# Altium schematic sheet IMU.SchDoc: Smart Bus Ticketing Machine/IMU
size A4; Date: 3/10/2025; ApprovedBy: Kiran Gunathilaka; CheckedBy: Kiran Gunathilaka; Author: Kiran Gunathilaka; DrawnBy: Kiran Gunathilaka; DocumentNumber: 05; Revision: v1.1; SheetNumber: 4; SheetTotal: 11
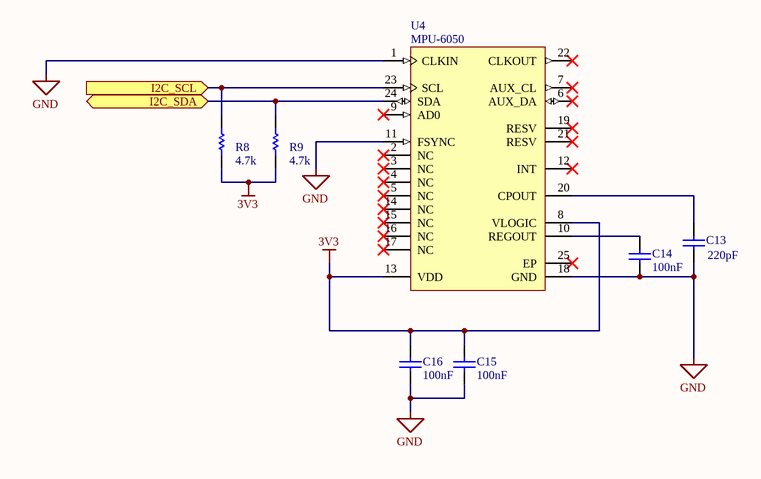
[diagram p0: IMU.SchDoc]

## Parts
C13  value 220pF  [CAPC2013X88X50ML20T25]  (hidden comment: C0805C221J5GACTU)
C14  value 100nF  [CAPC2013X94X50ML20T25]  (hidden comment: 08051C152KAT2A)
C15  value 100nF  [CAPC2013X94X50ML20T25]  (hidden comment: 08051C152KAT2A)
C16  value 100nF  [CAPC2013X94X50ML20T25]  (hidden comment: 08051C152KAT2A)
R8  value 4.7k  [RESC2013X60X40ML20T25]  (hidden comment: ERA6AEB472V)
R9  value 4.7k  [RESC2013X60X40ML20T25]  (hidden comment: ERA6AEB472V)
U4  MPU-6050  [IS-QFN-24_V]

## Ports
I2C_SCL (in, see Main[2C], MCU[3B]), I2C_SDA (bidir, see Main[2C], MCU[3B])

## Nets
3V3: C15.2 C16.2 R8.1 R9.1 U4.8(VLOGIC) U4.13(VDD)
GND: C13.1 C14.1 C15.1 C16.1 U4.1(CLKIN) U4.11(FSYNC) U4.18(GND)
I2C_SCL: R8.2 U4.23(SCL) ; port I2C_SCL
I2C_SDA: R9.2 U4.24(SDA) ; port I2C_SDA
NetC13_2: C13.2 U4.20(CPOUT)
NetC14_2: C14.2 U4.10(REGOUT)

Not connected (* = marked no-connect by the designer): U4 2(NC)* 3(NC)* 4(NC)* 5(NC)* 6(AUX_DA)* 7(AUX_CL)* 9(AD0)* 12(INT)* 14(NC)* 15(NC)* 16(NC)* 17(NC)* 19(RESV)* 21(RESV)* 22(CLKOUT)* 25(EP)*

## Library data of the parts
C13 = CMP-2007-00316-1: Manufacturer: Kemet; Part Number: C0805C221J5GACTU
C14-C16 = CMP-2007-04179-1: Manufacturer: AVX Interconnect / Elco; Part Number: 08051C152KAT2A
R8 R9 = CMP-2001-00644-1: Manufacturer: Panasonic; Part Number: ERA6AEB472V
U4 = CMP-1753-00002-2: 3-Axis Gyroscope, Accelerometer and a Digital Motion Processor(TM) (DMP), 2.375 to 3.46 V, -40 to 85 degC, 24-Pin QFN, RoHS, Tape and Reel; Manufacturer: InvenSense; Featured Product: MPU-60506-Axis,IntegratedI²CSolution; Other Names: 1428-1007-2 / MPU6050; Sensor Type: MotionTracking; Online Catalog: MPU-6000™Series; Unit PriceUSD: Digital; Datasheet Version: Rev. 3.3, 05/2012; Category: Sensors,Transducers; Datasheet URL: http://datasheet.octopart.com/MPU-6050-InvenSense-datasheet-14421344.pdf; Family: Multifunction; Standard Package: 5,000; Manufacturer URL: http://www.invensense.com/; Output Type: Digital; Dynamic Catalog: MPU-6000™Series